# Altium project UVMeter_PCB.PrjPcb
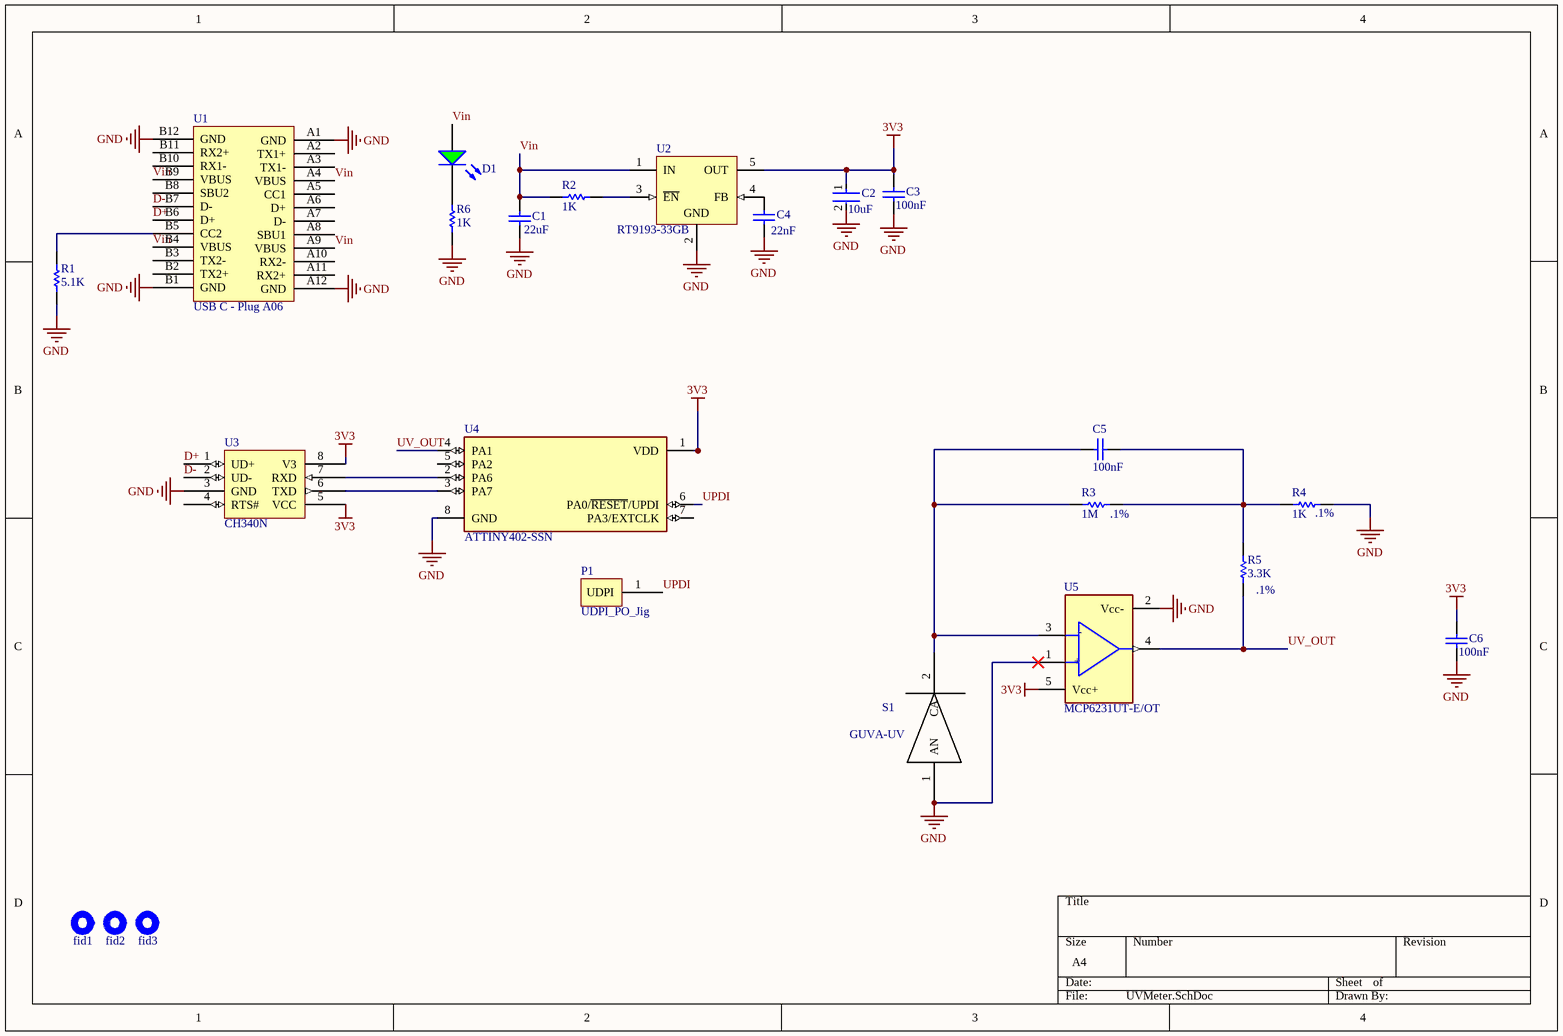
[diagram p0: UVMeter.SchDoc]
1 sheet, 23 parts. Net scope: global (net labels, ports and power ports of the same name join across sheets).
Board file: UVMeter.PcbDoc

## Sheet UVMeter.SchDoc
size A4

### Parts
C1  value 22uF  [CAPC2014X150X70NL20]
C2  Capacitance: 10uF  [FP-CL10-IPC_C]
C3  value 100nF  [CAPC1005X55X25ML05T10]
C4  value 22nF  [CAPC1005X55X25ML05T10]
C5  value 100nF  [CAPC1005X55X25ML05T10]
C6  value 100nF  [CAPC1005X55X25ML05T10]
D1  SML-P11MTT86  [ROHM-SML-P11MT_V]  (value not drawn)
fid1  FIDUCIAL  [FIDUCIAL]  (value not drawn)  (no BOM)
fid2  FIDUCIAL  [FIDUCIAL]  (value not drawn)  (no BOM)
fid3  FIDUCIAL  [FIDUCIAL]  (value not drawn)  (no BOM)
P1  UDPI_PO_Jig  [UDPI]
R1  value 5.1K  [RESC1005X40X25NL05T10]
R2  value 1K  [RESC1005X40X25NL05T10]
R3  value 1M  Tolerance: .1%  [RESC1005X40X25NL05T10]
R4  value 1K  Tolerance: .1%  [RESC1005X40X25NL05T10]
R5  value 3.3K  Tolerance: .1%  [RESC1005X40X25NL05T10]
R6  value 1K  [RESC1005X40X25NL05T10]
S1  GUVA-UV  [GUVA-S12SD]
U1  USB C - Plug A06  [USB C - Plug A06]
U2  RT9193-33GB  [DBV0005A_M]
U3  CH340N  [CH340N]
U4  ATTINY402-SSN  [FP-C04-057-SWB-IPC_B]
U5  MCP6231UT-E/OT  [FP-SOT23-5-GAMS1812131437-IPC_C]

### Nets
3V3: C2.1 C3.2 C6.2 U2.5(OUT) U3.5(VCC) U3.8(V3) U4.1(VDD) U5.5(Vcc+)
GND: C1.2 C2.2 C3.1 C4.1 C6.1 R1.1 R4.1 R6.1 S1.1(AN) U1.A1(GND) U1.A12(GND) U1.B1(GND) U1.B12(GND) U2.2(GND) U3.3(GND) U4.8(GND) U5.1(In+) U5.2(Vcc-)
D+: U1.B6(D+) U3.1(UD+)
D-: U1.B7(D-) U3.2(UD-)
UPDI: P1.1(UDPI) U4.6(PA0/~{RESET}/UPDI)
UV_OUT: R5.2 U4.4(PA1) U5.4(Out)
Vin: C1.1 D1.1(A) R2.2 U1.A4(VBUS) U1.A9(VBUS) U1.B4(VBUS) U1.B9(VBUS) U2.1(IN)
NetC4_2: C4.2 U2.4(FB)
NetC5_1: C5.1 R3.1 R4.2 R5.1
NetC5_2: C5.2 R3.2 S1.2(CA) U5.3(In-)
NetD1_2: D1.2(K) R6.2
NetR1_2: R1.2 U1.B5(CC2)
NetR2_1: R2.1 U2.3(~{EN})
NetU3_6: U3.6(TXD) U4.3(PA7)
NetU3_7: U3.7(RXD) U4.2(PA6)

Not connected (* = marked no-connect by the designer): U1 A2(TX1+) A3(TX1-) A5(CC1) A6(D+) A7(D-) A8(SBU1) A10(RX2-) A11(RX2+) B2(TX2+) B3(TX2-) B8(SBU2) B10(RX1-) B11(RX2+); U3 4(RTS#); U4 5(PA2) 7(PA3/EXTCLK)

### Notes on the sheet
- (in symbol CMP-12131-000010-1) -; +

### Library data of the parts
C1 = CMP-2007-00031-1: CAP TANT 22UF 20% 6.3V 0805; Manufacturer: AVX Interconnect / Elco; Part Number: TACR226M006XTA; MK: TMCP0J226MTRF
C2 = CMP-13271-001938-1: CAP CER 10UF 6.3V X5R 0603; Tolerance: 20%; Contact Plating: Tin; Height: 0.8mm; Width: 0.031inch; Min Operating Temperature: -55°C; Dielectric: X5R; Voltage Rating: 6.3V; Case/Package: 0603; Package Quantity: 1; Radiation Hardening: No; Packaging: Tape and Reel; Max Operating Temperature: 85°C; Voltage: 6.3V; Thickness: 0.035inch; Mount: Surface Mount; Case Code (Imperial): 0603; Case Code (Metric): 1608; Depth: 0.8mm; Length: 1.6mm
C3 C5 C6 = CMP-2008-04658-1: Manufacturer: Murata; Part Number: GRM155R71H332KA01D; MK: JMK107BJ106MA-T
C4 = CMP-2008-04658-1: Manufacturer: Murata; Part Number: GRM155R71H332KA01D; MK: 0402B223K160CT
D1 = CMP-2000-07126-1: LED Green, 54 mW, 20 mA, -40 to 85 degC, 2-Pin SMD, RoHS, Tape and Reel; Manufacturer: Rohm; Lens Type: Clear; Intensity: 2.1mcd; Forward Voltage: 1.9V; Forward (Drive) Current: 20mA; Package Description: 2-Pin Surface Mount Device, Body 0.6 x 1 mm; Mounting Technology: SurfaceMount; Datasheet Version: Rev. 2.0, 08/2012; Dimension: 1x0.6x0.2mm; Datasheet URL: https://datasheet.ciiva.com/16201/sml-p11mtt86-16201197.pdf; Manufacturer URL: http://www.rohm.com/web/global/; Color: Green; Package Reference: SML-P11MT
R1 R2 R6 = CMP-1011-00001-2: Manufacturer: Yageo / Phycomp; Part Number: RC0402JR-070RL; Tolerance: 5%
R3-R5 = CMP-1011-00001-2: Manufacturer: Yageo / Phycomp; Part Number: RC0402JR-070RL
U2 = CMP-0394-00352-2: IC REG LINEAR 3.3V 300MA SOT23-5; PartNumber: TPS76901HDBVT; Manufacturer: Texas Instruments; Accuracy(%): 3; Iout(Max)(A): 0.1; Iq(Typ)(mA): 0.3; Vin(Min)(V): 5; Rating: High Temp; Eco-Plan: Green (RoHS & no Sb/Br); Vdo(Typ)(mV): 71; Vout Adj(Min)(V): 1.2; SubFamily: Single Channel LDO; Vout Adj(Max)(V): 4.5; Vin(Max)(V): 10; ComponentLink2URL: http://www.ti.com/general/docs/lit/getliterature.tsp?genericPartNumber=TPS76901-HT&fileType=pdf; ComponentLink3Description: Package Specification; ComponentLink3URL: http://www.ti.com/litv/pdf/mpds018i; Mounting Technology: Surface Mount; PackageVersion: 4073253-4/K; ComponentLink4URL: Samples URL:http://www.ti.com/product/tps76901-ht#samples; PackageDescription: 5-Pin Plastic Small Outline, Body 1.60 Ãƒâ€” 2.90 mm, Pitch 0.95 mm; ComponentLink2Description: Datasheet; ComponentLink1URL: http://www.ti.com/; ComponentLink1Description: Manufacturer URL; DatasheetVersion: SLVS959C; Code_JEDEC: MO-178; ComponentLink4Description: URL Link1; PackageReference: DBV0005A; MK: RT9193-33GB
U3 = CH340N: USB to serial chip; MP: *; Package: SOP8
U4 = CMP-06276-000169-1: 20MHZ 4KB SOIC8 IND 105C GREEN T; RoHS Compliant: Yes
U5 = CMP-12131-000010-1: IC OPAMP GP 1 CIRCUIT SOT23-5; Manufacturer Part Number: LMV321LILT; Manufacturer: STMicroelectronics; Number Of Channels: 1; Input Bias Current: 0.027uA; Voltage Gain: 90dB; Min Supply Voltage: 2.7V; Output Current Per Channel: 43mA; Max Supply Voltage: 5.5V; Nominal Supply Current: 120-130uA; Gain Bandwidth: 1.3MHz; Input Offset Voltage: 1mV; Max Junction Temp: +150°C; ComponentLink2URL: https://www.st.com/resource/en/datasheet/lmv321l.pdf; Package: SOT23-5-GAMS1812131437CB; Lead Free: Yes; Temperature: -40°C to +125°C; Device Class L1: Integrated Circuits (ICs); Device Class L2: Linear ICs; Height: 1.45mm; Device Class L3: Amplifiers - Op Amps; Temperature Range Low: -40°C; Ambient Temperature Range High: +125°C; Mouser Description: Operational Amplifiers - Op Amps 1.3MHz LP Gen Op-Amp 250uA at 5V 7mV 25c; ComponentLink2Description: Datasheet; Automotive: No; Temperature Range High: +125°C; Octopart: https://octopart.com/lmv321lilt-stmicroelectronics-23014004; RoHS: TRUE; Digikey Description: IC OPAMP GP 1 CIRCUIT SOT23-5; Ipc Land Pattern Name: SOT95P280X120-5; Ambient Temperature Range Low: -40°C; Category: IC